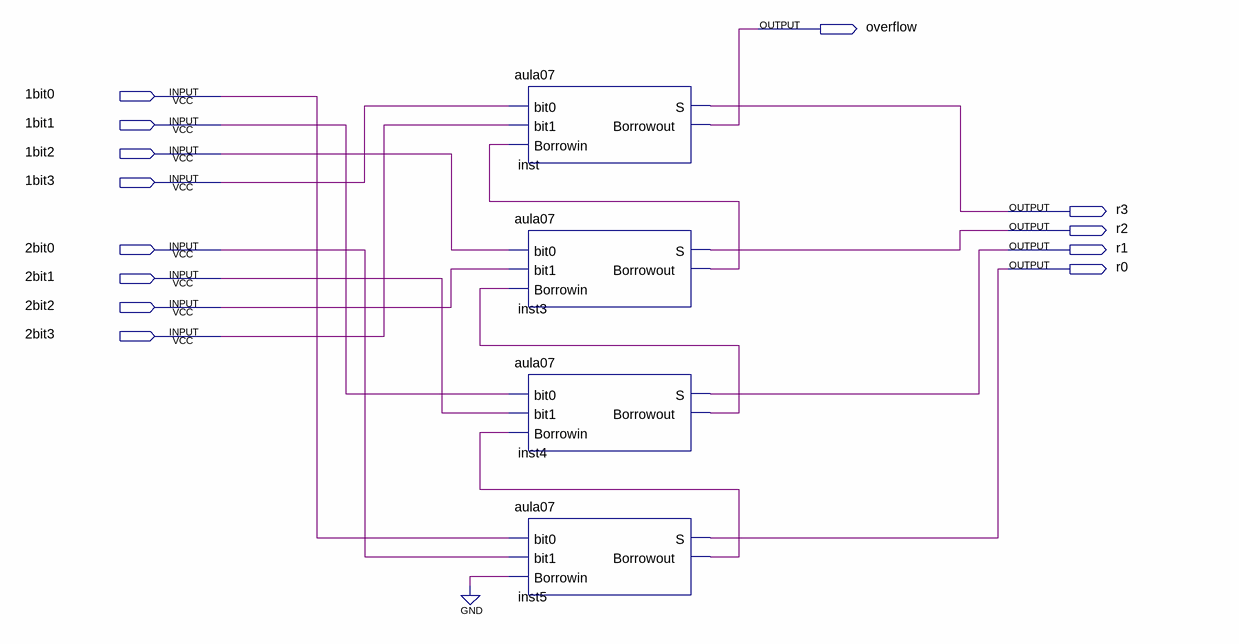
[diagram p0: schematic sheet]
// Quartus schematic aula08.bdf as structural Verilog: 4 symbols, 13 pins
module aula08 (
  input  \1bit0 ,
  input  \1bit1 ,
  input  \1bit2 ,
  input  \1bit3 ,
  input  \2bit0 ,
  input  \2bit1 ,
  input  \2bit2 ,
  input  \2bit3 ,
  output overflow,
  output r3,
  output r2,
  output r1,
  output r0
);

  wire inst3_borrowout, inst4_borrowout, inst5_borrowout;

  aula07 inst (.bit0(\1bit3 ), .bit1(\2bit3 ), .Borrowin(inst3_borrowout), .S(r3), .Borrowout(overflow));
  aula07 inst3 (.bit0(\1bit2 ), .bit1(\2bit2 ), .Borrowin(inst4_borrowout), .S(r2), .Borrowout(inst3_borrowout));
  aula07 inst4 (.bit0(\1bit1 ), .bit1(\2bit1 ), .Borrowin(inst5_borrowout), .S(r1), .Borrowout(inst4_borrowout));
  aula07 inst5 (.bit0(\1bit0 ), .bit1(\2bit0 ), .Borrowin(1'b0), .S(r0), .Borrowout(inst5_borrowout));
endmodule
